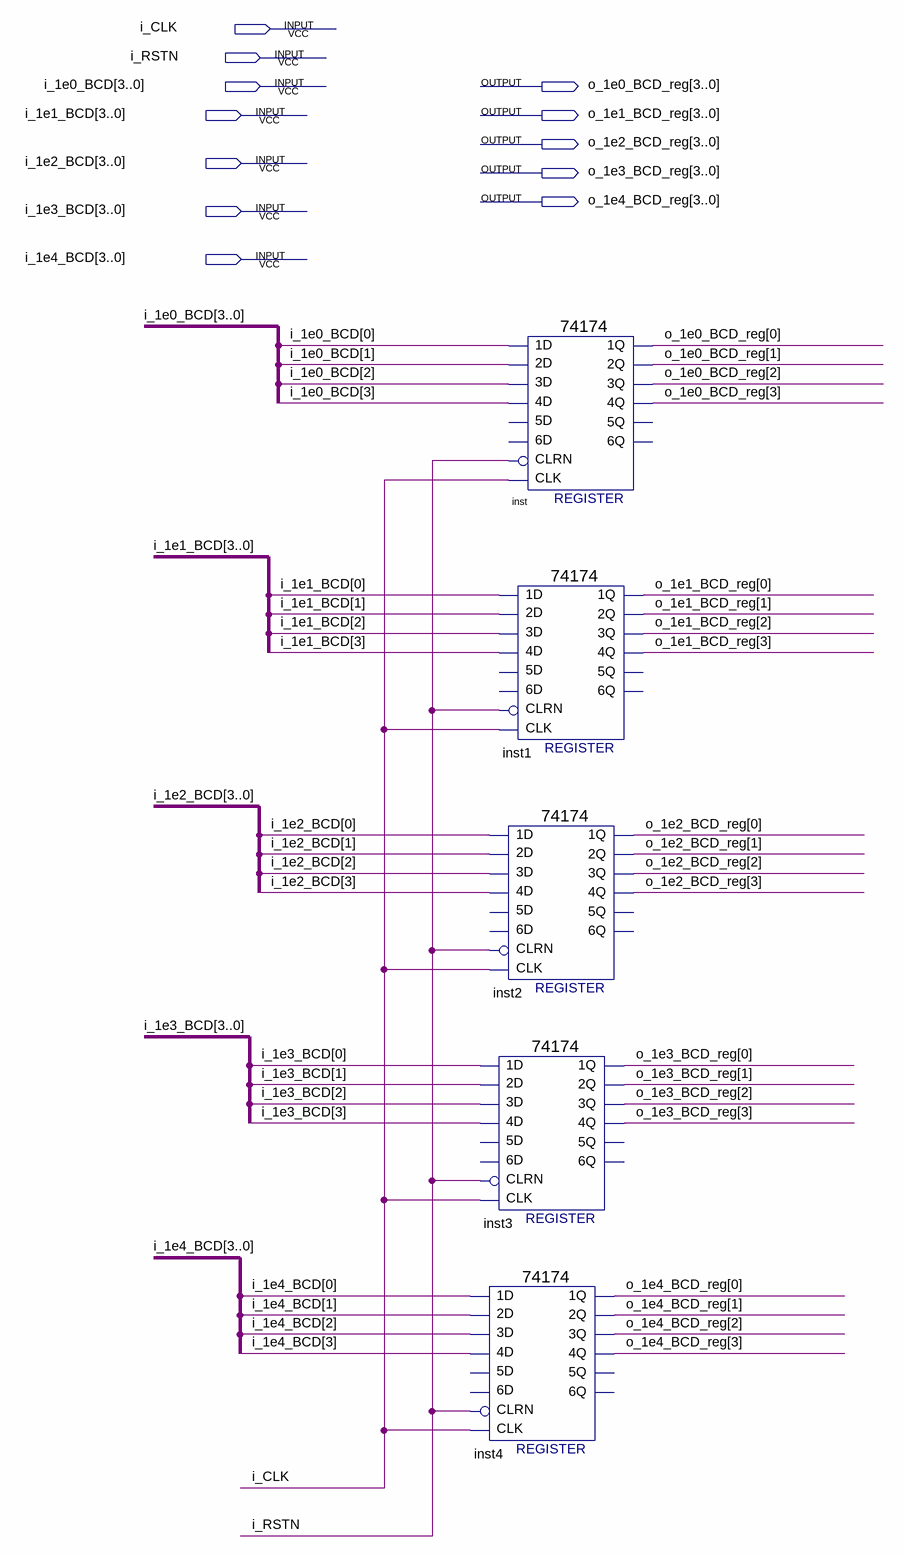
[diagram p0: schematic sheet]
// Quartus schematic bcd_20bits_reg.bdf as structural Verilog: 5 symbols, 12 pins
module bcd_20bits_reg (
  input  i_CLK,
  input  i_RSTN,
  input  [3:0] i_1e0_BCD,
  input  [3:0] i_1e1_BCD,
  input  [3:0] i_1e2_BCD,
  input  [3:0] i_1e3_BCD,
  input  [3:0] i_1e4_BCD,
  output [3:0] o_1e0_BCD_reg,
  output [3:0] o_1e1_BCD_reg,
  output [3:0] o_1e2_BCD_reg,
  output [3:0] o_1e3_BCD_reg,
  output [3:0] o_1e4_BCD_reg
);

  \74174  inst1 (
    .\4D (i_1e1_BCD[3]), .\3D (i_1e1_BCD[2]), .CLK(i_CLK), .CLRN(i_RSTN), .\1D (i_1e1_BCD[0]),
    .\2D (i_1e1_BCD[1]), .\1Q (o_1e1_BCD_reg[0]), .\4Q (o_1e1_BCD_reg[3]), .\3Q (o_1e1_BCD_reg[2]),
    .\2Q (o_1e1_BCD_reg[1]));  // open: 5D, 6D, 6Q, 5Q
  \74174  inst2 (
    .\4D (i_1e2_BCD[3]), .\3D (i_1e2_BCD[2]), .CLK(i_CLK), .CLRN(i_RSTN), .\1D (i_1e2_BCD[0]),
    .\2D (i_1e2_BCD[1]), .\1Q (o_1e2_BCD_reg[0]), .\4Q (o_1e2_BCD_reg[3]), .\3Q (o_1e2_BCD_reg[2]),
    .\2Q (o_1e2_BCD_reg[1]));  // open: 5D, 6D, 6Q, 5Q
  \74174  inst3 (
    .\4D (i_1e3_BCD[3]), .\3D (i_1e3_BCD[2]), .CLK(i_CLK), .CLRN(i_RSTN), .\1D (i_1e3_BCD[0]),
    .\2D (i_1e3_BCD[1]), .\1Q (o_1e3_BCD_reg[0]), .\4Q (o_1e3_BCD_reg[3]), .\3Q (o_1e3_BCD_reg[2]),
    .\2Q (o_1e3_BCD_reg[1]));  // open: 5D, 6D, 6Q, 5Q
  \74174  inst4 (
    .\4D (i_1e4_BCD[3]), .\3D (i_1e4_BCD[2]), .CLK(i_CLK), .CLRN(i_RSTN), .\1D (i_1e4_BCD[0]),
    .\2D (i_1e4_BCD[1]), .\1Q (o_1e4_BCD_reg[0]), .\4Q (o_1e4_BCD_reg[3]), .\3Q (o_1e4_BCD_reg[2]),
    .\2Q (o_1e4_BCD_reg[1]));  // open: 5D, 6D, 6Q, 5Q
  \74174  inst (
    .\4D (i_1e0_BCD[3]), .\3D (i_1e0_BCD[2]), .CLK(i_CLK), .CLRN(i_RSTN), .\1D (i_1e0_BCD[0]),
    .\2D (i_1e0_BCD[1]), .\1Q (o_1e0_BCD_reg[0]), .\4Q (o_1e0_BCD_reg[3]), .\3Q (o_1e0_BCD_reg[2]),
    .\2Q (o_1e0_BCD_reg[1]));  // open: 5D, 6D, 6Q, 5Q
endmodule
